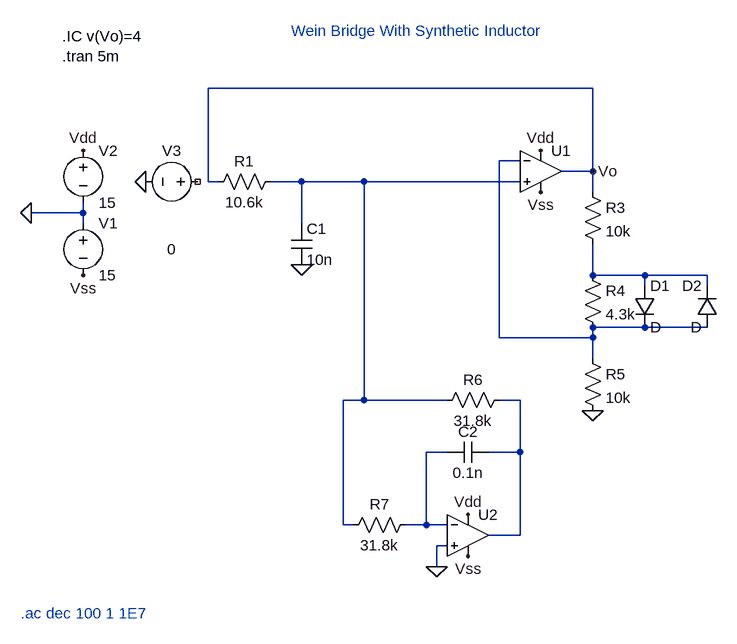
[diagram p0: schematic WeinBridgeSyntheticInductorDraft.asc]
WeinBridgeSyntheticInductorDraft.asc, the LTspice schematic file:
Version 4.1
SHEET 1 880 792
WIRE 608 -32 16 -32
WIRE 496 80 464 80
WIRE 608 96 608 -32
WIRE 608 96 560 96
WIRE 16 112 16 -32
WIRE 32 112 16 112
WIRE 160 112 112 112
WIRE 256 112 160 112
WIRE 496 112 256 112
WIRE 608 128 608 96
WIRE -176 160 -176 144
WIRE -176 160 -256 160
WIRE -176 176 -176 160
WIRE 160 176 160 112
WIRE 608 256 608 208
WIRE 688 256 608 256
WIRE 784 256 688 256
WIRE 688 272 688 256
WIRE 784 272 784 256
WIRE 688 336 608 336
WIRE 784 336 688 336
WIRE 464 352 464 80
WIRE 608 352 608 336
WIRE 608 352 464 352
WIRE 608 384 608 352
WIRE 256 448 256 112
WIRE 256 448 224 448
WIRE 384 448 256 448
WIRE 496 448 464 448
WIRE 384 528 352 528
WIRE 496 528 496 448
WIRE 496 528 448 528
WIRE 224 640 224 448
WIRE 240 640 224 640
WIRE 352 640 352 528
WIRE 352 640 320 640
WIRE 384 640 352 640
WIRE 496 656 496 528
WIRE 496 656 448 656
WIRE 384 672 368 672
WIRE 368 704 368 672
FLAG 160 240 0
FLAG -256 160 0
FLAG -176 256 Vss
FLAG -176 64 Vdd
FLAG 528 64 Vdd
FLAG 528 128 Vss
FLAG 608 464 0
FLAG 608 96 Vo
FLAG 416 688 Vss
FLAG 416 624 Vdd
FLAG 368 704 0
FLAG -80 112 0
SYMBOL res 128 96 R90
WINDOW 0 0 56 VBottom 2
WINDOW 3 32 56 VTop 2
SYMATTR InstName R1
SYMATTR Value 10.6k
SYMBOL cap 144 176 R0
SYMATTR InstName C1
SYMATTR Value 10n
SYMBOL OpAmps\\UniversalOpAmp2 528 96 R0
SYMATTR InstName U1
SYMBOL voltage -176 160 R0
WINDOW 123 0 0 Left 0
WINDOW 39 0 0 Left 0
SYMATTR InstName V1
SYMATTR Value 15
SYMBOL res 592 112 R0
SYMATTR InstName R3
SYMATTR Value 10k
SYMBOL res 592 240 R0
SYMATTR InstName R4
SYMATTR Value 4.3k
SYMBOL diode 672 272 R0
SYMATTR InstName D1
SYMBOL diode 800 336 R180
WINDOW 0 24 64 Left 2
WINDOW 3 24 0 Left 2
SYMATTR InstName D2
SYMBOL res 592 368 R0
SYMATTR InstName R5
SYMATTR Value 10k
SYMBOL voltage -176 48 R0
WINDOW 123 0 0 Left 0
WINDOW 39 0 0 Left 0
SYMATTR InstName V2
SYMATTR Value 15
SYMBOL OpAmps\\UniversalOpAmp2 416 656 R0
SYMATTR InstName U2
SYMBOL cap 448 512 R90
WINDOW 0 0 32 VBottom 2
WINDOW 3 32 32 VTop 2
SYMATTR InstName C2
SYMATTR Value 0.1n
SYMBOL res 480 432 R90
WINDOW 0 0 56 VBottom 2
WINDOW 3 32 56 VTop 2
SYMATTR InstName R6
SYMATTR Value 31.8k
SYMBOL res 336 624 R90
WINDOW 0 0 56 VBottom 2
WINDOW 3 32 56 VTop 2
SYMATTR InstName R7
SYMATTR Value 31.8k
SYMBOL voltage 16 112 R90
WINDOW 0 -32 56 VBottom 2
WINDOW 3 88 56 VTop 2
WINDOW 123 60 56 VTop 2
WINDOW 39 0 0 Left 0
SYMATTR InstName V3
SYMATTR Value 0
TEXT 144 -120 Left 2 ;Wein Bridge With Synthetic Inductor
TEXT -272 776 Left 2 ;.ac dec 100 1 1E7
TEXT -208 -112 Left 2 !.IC v(Vo)=4\n.tran 5m

The netlist it stands for:
* WeinBridgeSyntheticInductorDraft.asc
R1 N002 Vo 10.6k
C1 N002 0 10n
X§U1 N002 N001 Vdd Vss Vo level2 Avol=1Meg GBW=10Meg Slew=10Meg Ilimit=25m Rail=0 Vos=0 En=0 Enk=0 In=0 Ink=0 Rin=500Meg  ; pins In+ In- V+ V- OUT
V1 0 Vss 15
R3 Vo N003 10k
R4 N003 N001 4.3k
D1 N003 N001 D
D2 N001 N003 D
R5 N001 0 10k
V2 Vdd 0 15
X§U2 0 N005 Vdd Vss N004 level2 Avol=1Meg GBW=10Meg Slew=10Meg Ilimit=25m Rail=0 Vos=0 En=0 Enk=0 In=0 Ink=0 Rin=500Meg  ; pins In+ In- V+ V- OUT
C2 N004 N005 0.1n
R6 N004 N002 31.8k
R7 N005 N002 31.8k
V3 NC_01 0 0
.model D D
.lib standard.dio
* Wein Bridge With Synthetic Inductor
* .ac dec 100 1 1E7
.IC v(Vo)=4
.tran 5m
.lib UniversalOpAmp2.lib
.backanno
.end